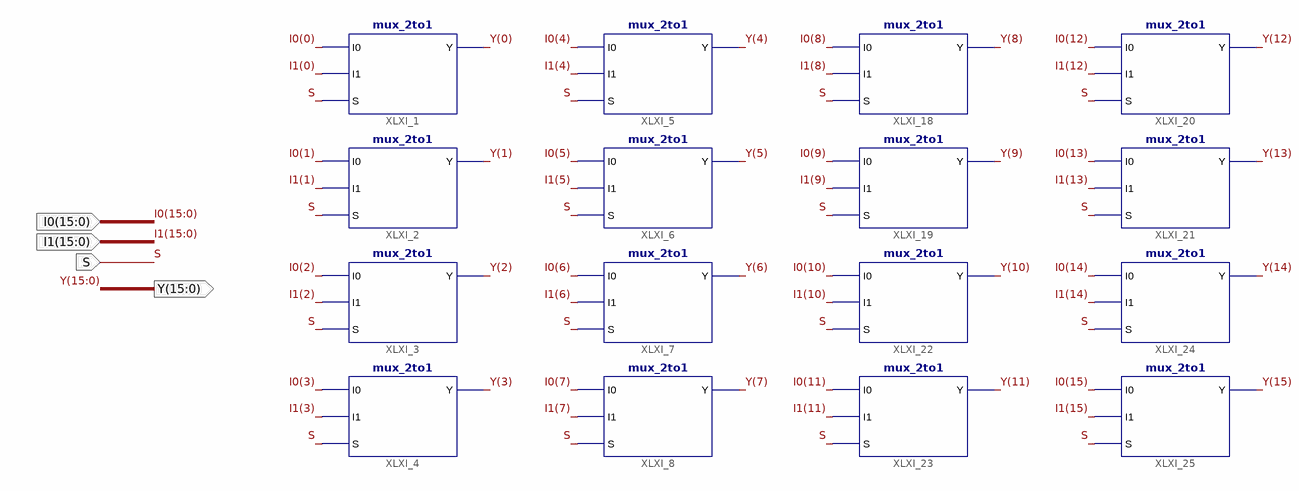
[diagram p0: schematic sheet 1]
// Xilinx ISE schematic mux_16bit_2to1.sch (virtex6) as structural Verilog: 16 symbols, 4 ports
module mux_16bit_2to1 (
  input  [15:0] I0,
  input  [15:0] I1,
  input  S,
  output [15:0] Y
);

  mux_2to1 XLXI_1 (.I0(I0[0]), .I1(I1[0]), .S(S), .Y(Y[0]));
  mux_2to1 XLXI_2 (.I0(I0[1]), .I1(I1[1]), .S(S), .Y(Y[1]));
  mux_2to1 XLXI_3 (.I0(I0[2]), .I1(I1[2]), .S(S), .Y(Y[2]));
  mux_2to1 XLXI_4 (.I0(I0[3]), .I1(I1[3]), .S(S), .Y(Y[3]));
  mux_2to1 XLXI_5 (.I0(I0[4]), .I1(I1[4]), .S(S), .Y(Y[4]));
  mux_2to1 XLXI_6 (.I0(I0[5]), .I1(I1[5]), .S(S), .Y(Y[5]));
  mux_2to1 XLXI_7 (.I0(I0[6]), .I1(I1[6]), .S(S), .Y(Y[6]));
  mux_2to1 XLXI_8 (.I0(I0[7]), .I1(I1[7]), .S(S), .Y(Y[7]));
  mux_2to1 XLXI_18 (.I0(I0[8]), .I1(I1[8]), .S(S), .Y(Y[8]));
  mux_2to1 XLXI_19 (.I0(I0[9]), .I1(I1[9]), .S(S), .Y(Y[9]));
  mux_2to1 XLXI_22 (.I0(I0[10]), .I1(I1[10]), .S(S), .Y(Y[10]));
  mux_2to1 XLXI_23 (.I0(I0[11]), .I1(I1[11]), .S(S), .Y(Y[11]));
  mux_2to1 XLXI_20 (.I0(I0[12]), .I1(I1[12]), .S(S), .Y(Y[12]));
  mux_2to1 XLXI_21 (.I0(I0[13]), .I1(I1[13]), .S(S), .Y(Y[13]));
  mux_2to1 XLXI_24 (.I0(I0[14]), .I1(I1[14]), .S(S), .Y(Y[14]));
  mux_2to1 XLXI_25 (.I0(I0[15]), .I1(I1[15]), .S(S), .Y(Y[15]));
endmodule
